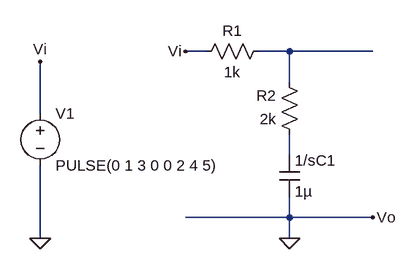
[diagram p0: schematic lag_compensator.asc]
lag_compensator.asc, the LTspice schematic file:
Version 4
SHEET 1 1532 1056
WIRE -1552 320 -1584 320
WIRE -1424 320 -1472 320
WIRE -1296 320 -1424 320
WIRE -1424 368 -1424 320
WIRE -1808 416 -1808 336
WIRE -1424 480 -1424 448
WIRE -1424 576 -1424 544
WIRE -1424 576 -1584 576
WIRE -1296 576 -1424 576
WIRE -1808 608 -1808 496
WIRE -1424 608 -1424 576
FLAG -1808 608 0
FLAG -1584 320 Vi
FLAG -1296 576 Vo
FLAG -1808 336 Vi
FLAG -1424 608 0
SYMBOL voltage -1808 400 R0
WINDOW 123 0 0 Left 0
WINDOW 39 0 0 Left 0
SYMATTR InstName V1
SYMATTR Value PULSE(0 1 3 0 0 2 4 5)
SYMBOL cap -1440 480 R0
SYMATTR InstName 1/sC1
SYMATTR Value 1µ
SYMBOL res -1456 304 R90
WINDOW 0 0 56 VBottom 2
WINDOW 3 32 56 VTop 2
SYMATTR InstName R1
SYMATTR Value 1k
SYMBOL res -1408 464 R180
WINDOW 0 36 76 Left 2
WINDOW 3 36 40 Left 2
SYMATTR InstName R2
SYMATTR Value 2k

The netlist it stands for:
* lag_compensator.asc
V1 Vi 0 PULSE(0 1 3 0 0 2 4 5)
C§1/sC1 N002 0 1µ
R1 N001 Vi 1k
R2 N002 N001 2k
.backanno
.end